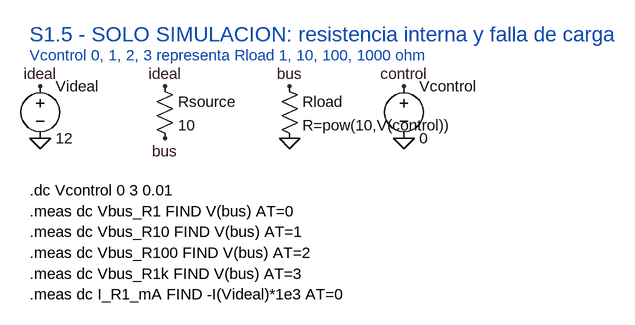
[diagram p0: schematic semana1_05_fuente_y_falla.asc]
semana1_05_fuente_y_falla.asc, the LTspice schematic file:
Version 4
SHEET 1 880 680
SYMBOL voltage 64 112 R0
SYMATTR InstName Videal
SYMATTR Value 12
SYMBOL res 240 112 R0
SYMATTR InstName Rsource
SYMATTR Value 10
SYMBOL res 432 112 R0
SYMATTR InstName Rload
SYMATTR Value R=pow(10,V(control))
SYMBOL voltage 624 112 R0
SYMATTR InstName Vcontrol
SYMATTR Value 0
FLAG 64 128 ideal
FLAG 64 208 0
FLAG 256 128 ideal
FLAG 256 208 bus
FLAG 448 128 bus
FLAG 448 208 0
FLAG 624 128 control
FLAG 624 208 0
TEXT 48 288 Left 2 !.dc Vcontrol 0 3 0.01
TEXT 48 320 Left 2 !.meas dc Vbus_R1 FIND V(bus) AT=0
TEXT 48 352 Left 2 !.meas dc Vbus_R10 FIND V(bus) AT=1
TEXT 48 384 Left 2 !.meas dc Vbus_R100 FIND V(bus) AT=2
TEXT 48 416 Left 2 !.meas dc Vbus_R1k FIND V(bus) AT=3
TEXT 48 448 Left 2 !.meas dc I_R1_mA FIND -I(Videal)*1e3 AT=0
TEXT 48 48 Left 3 ;S1.5 - SOLO SIMULACION: resistencia interna y falla de carga
TEXT 48 80 Left 2 ;Vcontrol 0, 1, 2, 3 representa Rload 1, 10, 100, 1000 ohm

The netlist it stands for:
* semana1_05_fuente_y_falla.asc
Videal ideal 0 12
Rsource ideal bus 10
Rload bus 0 R=pow(10,V(control))
Vcontrol control 0 0
.dc Vcontrol 0 3 0.01
.meas dc Vbus_R1 FIND V(bus) AT=0
.meas dc Vbus_R10 FIND V(bus) AT=1
.meas dc Vbus_R100 FIND V(bus) AT=2
.meas dc Vbus_R1k FIND V(bus) AT=3
.meas dc I_R1_mA FIND -I(Videal)*1e3 AT=0
* S1.5 - SOLO SIMULACION: resistencia interna y falla de carga
* Vcontrol 0, 1, 2, 3 representa Rload 1, 10, 100, 1000 ohm
.backanno
.end